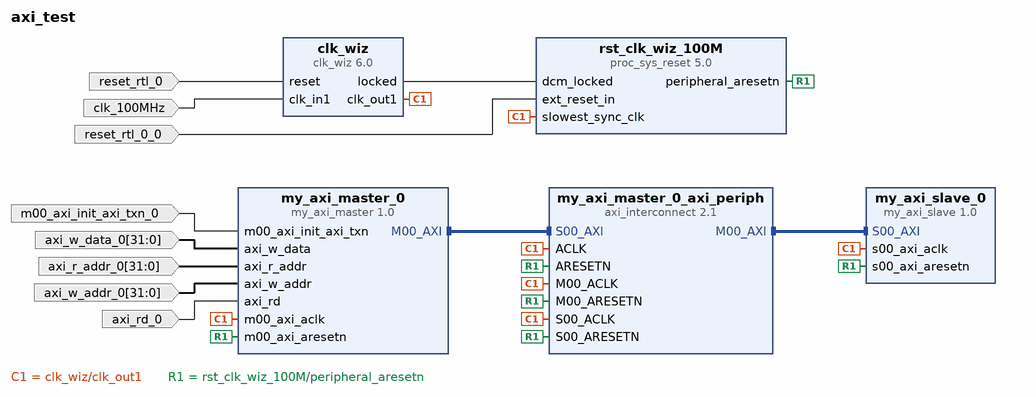
[diagram p0: block diagram of the top level]
# Vivado block design axi_test, xc7z020clg400-1, Vivado 2018.3
create_bd_design axi_test

create_bd_port -dir I -type rst reset_rtl_0
set_property -dict {CONFIG.POLARITY ACTIVE_HIGH} [get_bd_ports reset_rtl_0]
create_bd_port -dir I -type clk clk_100MHz
set_property -dict {CONFIG.FREQ_HZ 100000000} [get_bd_ports clk_100MHz]
create_bd_port -dir I -type rst reset_rtl_0_0
set_property -dict {CONFIG.POLARITY ACTIVE_LOW} [get_bd_ports reset_rtl_0_0]
create_bd_port -dir I m00_axi_init_axi_txn_0
create_bd_port -dir I -from 31 -to 0 axi_w_data_0
create_bd_port -dir I -from 31 -to 0 axi_r_addr_0
create_bd_port -dir I -from 31 -to 0 axi_w_addr_0
create_bd_port -dir I axi_rd_0

create_bd_cell -type ip -vlnv xilinx.com:user:my_axi_slave:1.0 my_axi_slave_0
create_bd_cell -type ip -vlnv xilinx.com:ip:axi_interconnect:2.1 my_axi_master_0_axi_periph
set_property -dict {CONFIG.NUM_MI 1} [get_bd_cells my_axi_master_0_axi_periph]
create_bd_cell -type ip -vlnv xilinx.com:ip:clk_wiz:6.0 clk_wiz
create_bd_cell -type ip -vlnv xilinx.com:ip:proc_sys_reset:5.0 rst_clk_wiz_100M
create_bd_cell -type ip -vlnv xilinx.com:user:my_axi_master:1.0 my_axi_master_0

# ---- connections ----

connect_bd_intf_net [get_bd_intf_pins my_axi_master_0/M00_AXI] [get_bd_intf_pins my_axi_master_0_axi_periph/S00_AXI]
connect_bd_intf_net [get_bd_intf_pins my_axi_master_0_axi_periph/M00_AXI] [get_bd_intf_pins my_axi_slave_0/S00_AXI]
connect_bd_net [get_bd_pins clk_wiz/clk_out1] \
  [get_bd_pins my_axi_master_0_axi_periph/S00_ACLK] [get_bd_pins rst_clk_wiz_100M/slowest_sync_clk] \
  [get_bd_pins my_axi_slave_0/s00_axi_aclk] [get_bd_pins my_axi_master_0_axi_periph/M00_ACLK] \
  [get_bd_pins my_axi_master_0_axi_periph/ACLK] [get_bd_pins my_axi_master_0/m00_axi_aclk]
connect_bd_net [get_bd_pins clk_wiz/locked] [get_bd_pins rst_clk_wiz_100M/dcm_locked]
connect_bd_net [get_bd_pins rst_clk_wiz_100M/peripheral_aresetn] \
  [get_bd_pins my_axi_master_0_axi_periph/S00_ARESETN] [get_bd_pins my_axi_slave_0/s00_axi_aresetn] \
  [get_bd_pins my_axi_master_0_axi_periph/M00_ARESETN] [get_bd_pins my_axi_master_0_axi_periph/ARESETN] \
  [get_bd_pins my_axi_master_0/m00_axi_aresetn]
connect_bd_net -net reset_rtl_0_1 [get_bd_ports reset_rtl_0] [get_bd_pins clk_wiz/reset]
connect_bd_net [get_bd_ports clk_100MHz] [get_bd_pins clk_wiz/clk_in1]
connect_bd_net -net reset_rtl_0_0_1 [get_bd_ports reset_rtl_0_0] [get_bd_pins rst_clk_wiz_100M/ext_reset_in]
connect_bd_net -net m00_axi_init_axi_txn_0_1 [get_bd_ports m00_axi_init_axi_txn_0] [get_bd_pins my_axi_master_0/m00_axi_init_axi_txn]
connect_bd_net -net axi_w_data_0_1 [get_bd_ports axi_w_data_0] [get_bd_pins my_axi_master_0/axi_w_data]
connect_bd_net -net axi_r_addr_0_1 [get_bd_ports axi_r_addr_0] [get_bd_pins my_axi_master_0/axi_r_addr]
connect_bd_net -net axi_w_addr_0_1 [get_bd_ports axi_w_addr_0] [get_bd_pins my_axi_master_0/axi_w_addr]
connect_bd_net -net axi_rd_0_1 [get_bd_ports axi_rd_0] [get_bd_pins my_axi_master_0/axi_rd]

# ---- address map ----
assign_bd_address -offset 0x44A00000 -range 64K -target_address_space [get_bd_addr_spaces my_axi_master_0/M00_AXI] [get_bd_addr_segs my_axi_slave_0/S00_AXI/S00_AXI_reg]

validate_bd_design
save_bd_design
